# Altium schematic sheet WC_PWR.SchDoc
size A; Organization: Altium Limited; Address1: L3, 12a Rodborough Rd; Address2: Frenchs Forest; Address3: NSW; Address4: Australia 2086; DocumentNumber: 3; SheetNumber: 3; SheetTotal: 11
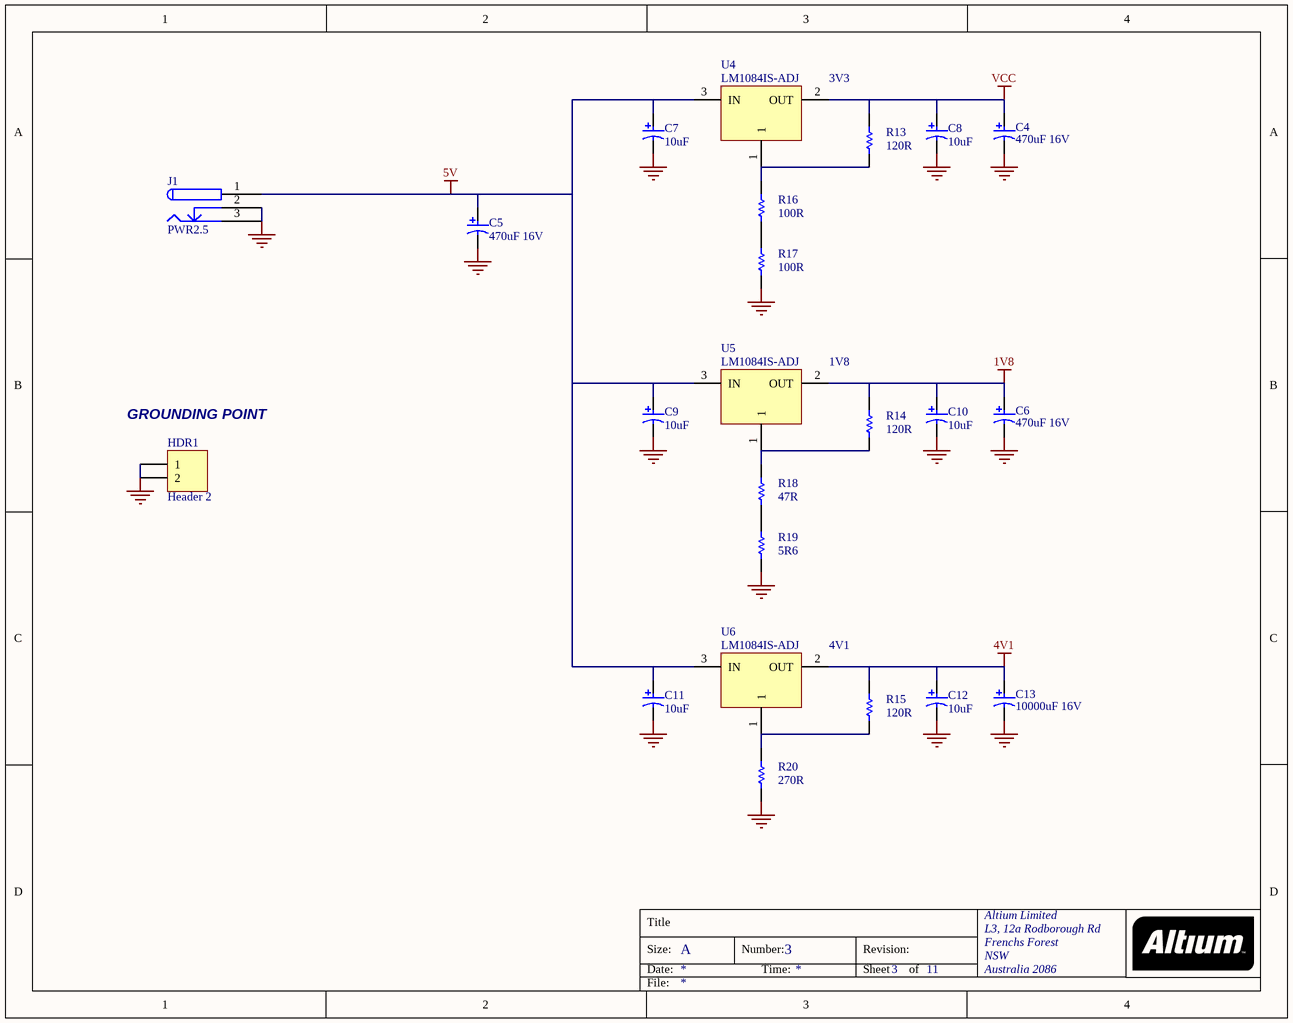
[diagram p0: WC_PWR.SchDoc]

## Parts
C4  470uF 16V  [RB8/3.5]
C5  470uF 16V  [RB8/3.5]
C6  470uF 16V  [RB8/3.5]
C7  10uF  [MCCT-B]
C8  10uF  [MCCT-B]
C9  10uF  [MCCT-B]
C10  10uF  [MCCT-B]
C11  10uF  [MCCT-B]
C12  10uF  [MCCT-B]
C13  10000uF 16V  [RB18/7.5]
HDR1  Header 2  [HDR1X2]
J1  PWR2.5  [PWR2.5]
R13  120R  [CC2012-0805]
R14  120R  [CC2012-0805]
R15  120R  [CC2012-0805]
R16  100R  [CC2012-0805]
R17  100R  [CC2012-0805]
R18  47R  [CC2012-0805]
R19  5R6  [CC2012-0805]
R20  270R  [CC2012-0805]
U4  LM1084IS-ADJ  [TO-263]
U5  LM1084IS-ADJ  [TO-263]
U6  LM1084IS-ADJ  [TO-263]

## Nets
1V8: C6.1 C10.1 R14.1 U5.2(OUT)
4V1: C12.1 C13.1 R15.1 U6.2(OUT)
5V: C5.1 C7.1 C9.1 C11.1 J1.1 U4.3(IN) U5.3(IN) U6.3(IN)
GND: C4.2 C5.2 C6.2 C7.2 C8.2 C9.2 C10.2 C11.2 C12.2 C13.2 HDR1.1 HDR1.2 J1.2 J1.3 R17.2 R19.2 R20.2
VCC: C4.1 C8.1 R13.1 U4.2(OUT)
NetR13_2: R13.2 R16.1 U4.1
NetR14_2: R14.2 R18.1 U5.1
NetR15_2: R15.2 R20.1 U6.1
NetR16_2: R16.2 R17.1
NetR18_2: R18.2 R19.1

## Notes on the sheet
- 3V3
- 1V8
- (near HDR1) GROUNDING POINT
- 4V1
- Title
- Size:
- Date:
- A
- Number:
- Time:
- Revision:
- Sheet
- of
- File:

## Library data of the parts
C4-C13 = CAP_POLAR: Polar Capacitor
HDR1 = Header 2: Header, 2-Pin; Manufacturer: Generic Components; Class I: Connector; Revision: July-2002: Re-released for DXP Platform.; Publisher: Altium Limited
J1 = PWR2.5: Low Voltage Power Supply Sonnector
R13-R20 = RES: Resistor
U4-U6 = LM1084IS-ADJ: 5A Low Dropout Possitive Regulators